# EAGLE board HP85disk_03 (EAGLE 9.2.2)
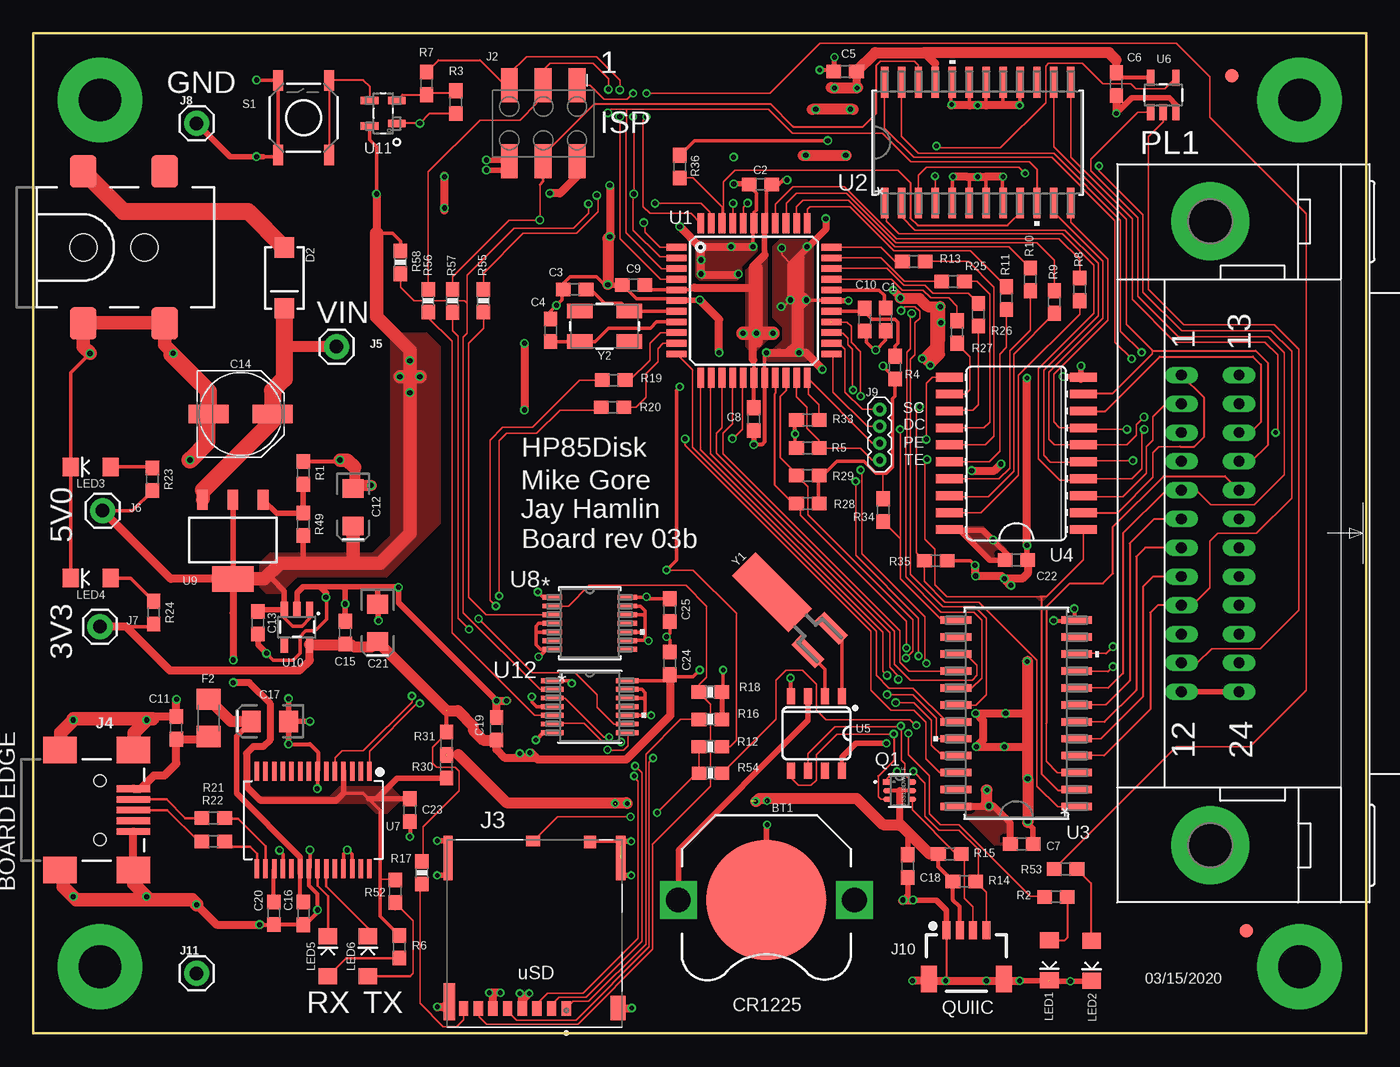
[diagram p2: board, top side]
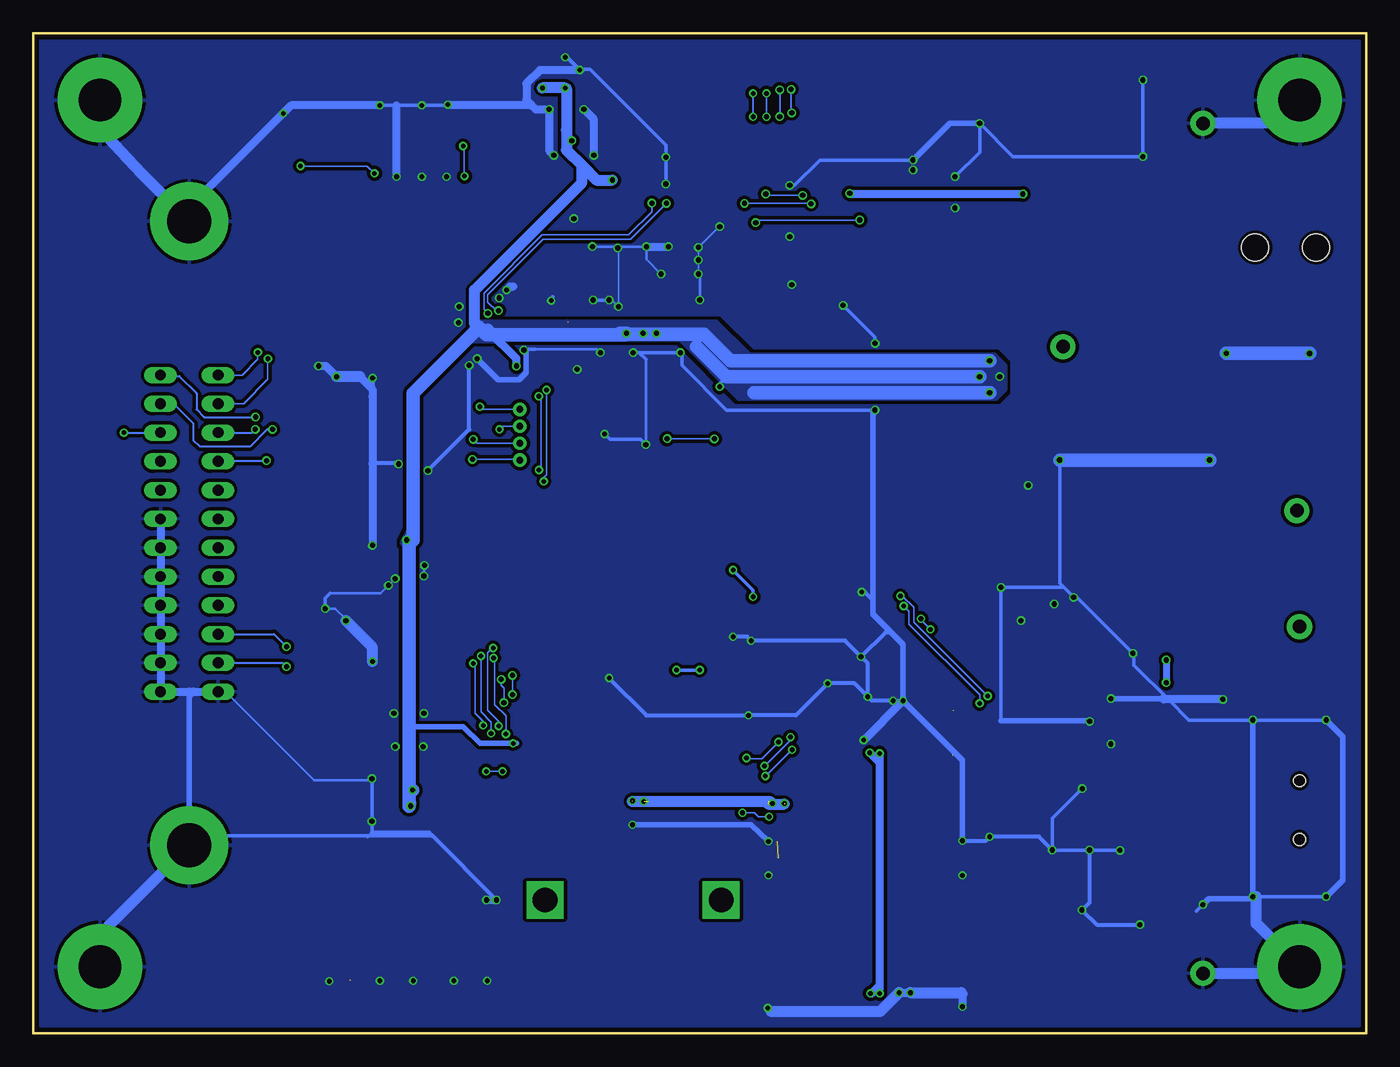
[diagram p3: board, bottom side, seen from below]

Size 100 x 75 mm. Coordinates in mm from the lower left corner, seen from the top.
Outline: 0,75 100,75 100,0 0,0 0,75
Copper layers (1*16): Top 0.035mm / dielectric 1.5mm / Bottom 0.035mm
Design rules "SparkFun-2-layer-FAB-LIMIT": minimum track width 4mil, minimum drill 6mil, track to track 4mil, track to pad 4mil, pad to pad 4mil, via to via 4mil, smd to smd 4mil, copper to edge 4mil, drill to drill 4mil, minimum pad ring 5mil, minimum via ring 5mil, stop-mask expansion 4mil, vias tented up to drill 25mil, thermal gap 10mil
Net classes: 0 default: width 0.102 mm, drill 0.305 mm, clearance 0.102 mm
vRestrict: area 0.6,22.4 to 2,30.6; area 5.7,23.1 to 7.4,30.6; area 47.9,10.8 to 48.5,11.3; area 50.4,10.7 to 50.9,11.6; area 11.3,29.3 to 12.7,31.6; area 0.3,13 to 9.4,25

## Footprints (pad centres in the part's own frame; a part is rotated, then mirrored left to right if it is on the bottom)
BATTCON_12MM_PTH = smd 9 x 9: GND 0,0 | drill 1.854 square: VCC@1 6.604,0; VCC@2 -6.604,0
0603 = smd 1.1 x 1: 1 -0.85,0; 2 0.85,0
EIA3216 = smd 1.4 x 1.6: + 1.4,0; - -1.4,0
PANASONIC_D = smd 3 x 1.4: + 2.4,0; - -2.4,0
SMA-DIODE = smd 1.524 x 1.47: A -2.277,0; C 2.277,0
1206 = smd 1.6 x 1.8: 1 -1.4,0; 2 1.4,0
STANDOFF-ELECTRICAL = drill 3.2 pad 6.35: P1 0,0
POWER_JACK_SMD_OVERPASTE_SUPER_BOMB_DIGITY = smd 2 x 2.4: GND 0,-5.7; P$4 6.1,-5.7; VIN0 0,5.7; VIN1 6.1,5.7 | hole 2.032: 0,0; 4.572,0
2X3_SMD = smd 1.27 x 2.54: 1 -2.54,-2.85; 2 -2.54,2.85; 3 0,-2.85; 4 0,2.85; 5 2.54,-2.85; 6 2.54,2.85
MOLEX_503398-1892 = smd 0.7 x 1.1: 1 -2.38,5.625; 2 -1.28,5.625; 3 -0.18,5.625; 4 0.92,5.625; 5 2.02,5.625; 6 3.12,5.625; 7 4.22,5.625; 8 5.32,5.625 | smd 0.9 x 0.93: 9 -4.17,-6.84 | smd 1.05 x 0.78: 10 0.095,-6.915 | smd 1.14 x 1.83: P1 -6.26,5.61 | smd 0.86 x 2.8: P2 6.4,5.125 | smd 0.7 x 3.33: P3 -6.48,-5.64; P4 6.48,-5.64
USB-MINIB = smd 2.5 x 0.5: D+ 2.5,0; D- 2.5,0.8; GND 2.5,-1.6; ID 2.5,-0.8; VBUS 2.5,1.6 | smd 2.5 x 2: S1 -3,4.5; S2 2.5,4.5; S3 -3,-4.5; S4 2.5,-4.5 | hole 0.9: 0,2.2; 0,-2.2
1X01 = drill 1.016 pad 1.88: 1 0,0
1X04_1.27MM = drill 0.508 pad 1: 1 0,0; 2 1.27,0; 3 2.54,0; 4 3.81,0
QUIIC_1X04_1MM_RA = smd 0.6 x 1.35: 1 -1.5,0; 2 -0.5,0; 3 0.5,0; 4 1.5,0 | smd 1.2 x 2: G1 -2.8,-3.675; G2 2.8,-3.675
FIDUCIAL-1X2 = smd 1 x 1: 1 0,0
LED-1206 = smd 1.2 x 1.4: A -1.5,0; C 1.5,0
24HP = drill 0.813 long: 1 -11.874,-2.159; 2 -9.716,-2.159; 3 -7.556,-2.159; 4 -5.397,-2.159; 5 -3.239,-2.159; 6 -1.079,-2.159; 7 1.079,-2.159; 8 3.239,-2.159; 9 5.397,-2.159; 10 7.556,-2.159; 11 9.716,-2.159; 12 11.874,-2.159; 13 -11.874,2.159; 14 -9.716,2.159; 15 -7.556,2.159; 16 -5.397,2.159; 17 -3.239,2.159; 18 -1.079,2.159; 19 1.079,2.159; 20 3.239,2.159; 21 5.397,2.159; 22 7.556,2.159; 23 9.716,2.159; 24 11.874,2.159 | drill 3.302 pad 5.842: G -23.393,0; G1 23.393,0
SOT-363 = smd 0.6 x 0.42: 1 -0.95,0.65; 2 -0.95,0; 3 -0.95,-0.65; 4 0.95,-0.65; 5 0.95,0; 6 0.95,0.65
0603-RES = smd 1.1 x 1: 1 -0.85,0; 2 0.85,0
TACTILE-SWITCH-SMD = smd 1.524 x 0.762: 1 -2.794,1.905; 2 2.794,1.905; 3 -2.794,-1.905; 4 2.794,-1.905
TQFP44 = smd 1.5 x 0.5: 1 -5.8,4; 2 -5.8,3.2; 3 -5.8,2.4; 4 -5.8,1.6; 5 -5.8,0.8; 6 -5.8,0; 7 -5.8,-0.8; 8 -5.8,-1.6; 9 -5.8,-2.4; 10 -5.8,-3.2; 11 -5.8,-4; 23 5.8,-4; 24 5.8,-3.2; 25 5.8,-2.4; 26 5.8,-1.6; 27 5.8,-0.8; 28 5.8,0; 29 5.8,0.8; 30 5.8,1.6; 31 5.8,2.4; 32 5.8,3.2; 33 5.8,4 | smd 0.5 x 1.5: 12 -4,-5.8; 13 -3.2,-5.8; 14 -2.4,-5.8; 15 -1.6,-5.8; 16 -0.8,-5.8; 17 0,-5.8; 18 0.8,-5.8; 19 1.6,-5.8; 20 2.4,-5.8; 21 3.2,-5.8; 22 4,-5.8; 34 4,5.8; 35 3.2,5.8; 36 2.4,5.8; 37 1.6,5.8; 38 0.8,5.8; 39 0,5.8; 40 -0.8,5.8; 41 -1.6,5.8; 42 -2.4,5.8; 43 -3.2,5.8; 44 -4,5.8
DW24 = smd 2.311 x 0.559: 1 -4.521,6.985; 2 -4.521,5.715; 3 -4.521,4.445; 4 -4.521,3.175; 5 -4.521,1.905; 6 -4.521,0.635; 7 -4.521,-0.635; 8 -4.521,-1.905; 9 -4.521,-3.175; 10 -4.521,-4.445; 11 -4.521,-5.715; 12 -4.521,-6.985; 13 4.521,-6.985; 14 4.521,-5.715; 15 4.521,-4.445; 16 4.521,-3.175; 17 4.521,-1.905; 18 4.521,-0.635; 19 4.521,0.635; 20 4.521,1.905; 21 4.521,3.175; 22 4.521,4.445; 23 4.521,5.715; 24 4.521,6.985
SO20L = smd 0.66 x 2.032: 1 -5.715,-5.029; 2 -4.445,-5.029; 3 -3.175,-5.029; 4 -1.905,-5.029; 5 -0.635,-5.029; 6 0.635,-5.029; 7 1.905,-5.029; 8 3.175,-5.029; 9 4.445,-5.029; 10 5.715,-5.029; 11 5.715,5.029; 12 4.445,5.029; 13 3.175,5.029; 14 1.905,5.029; 15 0.635,5.029; 16 -0.635,5.029; 17 -1.905,5.029; 18 -3.175,5.029; 19 -4.445,5.029; 20 -5.715,5.029
SO08-0.15 = smd 0.6 x 1.2: 1 -1.905,-2.8; 2 -0.635,-2.8; 3 0.635,-2.8; 4 1.905,-2.8; 5 1.905,2.8; 6 0.635,2.8; 7 -0.635,2.8; 8 -1.905,2.8
SOT23-5 = smd 0.55 x 1.2: 1 -0.95,-1.3; 2 0,-1.3; 3 0.95,-1.3; 4 0.95,1.3; 5 -0.95,1.3
SSOP28DB = smd 0.348 x 1.397: 1 -4.225,-3.656; 2 -3.575,-3.656; 3 -2.925,-3.656; 4 -2.275,-3.656; 5 -1.625,-3.656; 6 -0.975,-3.656; 7 -0.325,-3.656; 8 0.325,-3.656; 9 0.975,-3.656; 10 1.625,-3.656; 11 2.275,-3.656; 12 2.925,-3.656; 13 3.575,-3.656; 14 4.225,-3.656; 15 4.225,3.656; 16 3.575,3.656; 17 2.925,3.656; 18 2.275,3.656; 19 1.625,3.656; 20 0.975,3.656; 21 0.325,3.656; 22 -0.325,3.656; 23 -0.975,3.656; 24 -1.625,3.656; 25 -2.275,3.656; 26 -2.925,3.656; 27 -3.575,3.656; 28 -4.225,3.656
TSSOP14_4P50X5P10 = smd 1.473 x 0.356: 1 -2.819,1.95; 2 -2.819,1.3; 3 -2.819,0.65; 4 -2.819,0; 5 -2.819,-0.65; 6 -2.819,-1.3; 7 -2.819,-1.95; 8 2.819,-1.95; 9 2.819,-1.3; 10 2.819,-0.65; 11 2.819,0; 12 2.819,0.65; 13 2.819,1.3; 14 2.819,1.95
SOT223-ALT1 = smd 0.813 x 1.524: 1 -2.271,-3.02; 2 0,-3.02; 3 2.288,-3.02 | smd 3.124 x 1.905: 4 0,2.921
21-0052F = smd 0.559 x 1.321: 1 -0.775,-1.016; 2 0.965,-1.016; 3 0.965,1.016; 4 -0.965,1.016
PW14 = smd 1.676 x 0.356: 1 -2.819,1.95; 2 -2.819,1.3; 3 -2.819,0.65; 4 -2.819,0; 5 -2.819,-0.65; 6 -2.819,-1.3; 7 -2.819,-1.95; 8 2.819,-1.95; 9 2.819,-1.3; 10 2.819,-0.65; 11 2.819,0; 12 2.819,0.65; 13 2.819,1.3; 14 2.819,1.95
CRYSTAL-SMD-2X6-CYL = smd 2.5 x 6: SHEILD 0,5.08 | smd 1 x 2.5: X1 -1.27,0; X2 1.27,0
CRYSTAL-SMD-5X3.2-4PAD = smd 1.9 x 1.1: 1 -1.85,-1.15; 2 1.85,-1.15; 3 1.85,1.15; 4 -1.85,1.15

## Placement (x,y rotation side)
BT1  [BATTCON_12MM_PTH]  55,10 180 top
C1  0.1uF  [0603]  63.94,53.54 270 top
C2  0.1uF  [0603]  54.56,63.67 0 top
C3  22pF  [0603]  40.62,55.8 0 top
C4  22pF  [0603]  38.81,52.73 270 top
C5  0.1uF  [0603]  60.91,72.14 0 top
C6  0.1uF  [0603]  81.25,71.19 90 top
C7  0.1uF  [0603]  74.15,14.2 180 top
C8  0.1uF  [0603]  54.06,46.07 90 top
C9  0.1uF  [0603]  45.03,56.12 0 top
C10  0.1uF  [0603]  62.37,53.53 270 top
C11  0.1uF  [0603]  10.73,22.91 90 top
C12  10uF  [EIA3216]  23.99,39.46 270 top
C13  0.1uF  [0603]  16.85,30.79 270 top
C14  47uF  [PANASONIC_D]  15.55,46.45 0 top
C15  1.0uF  [0603]  23.4,30.06 90 top
C16  0.1uF  [0603]  20.27,8.99 270 top
C17  10uF  [EIA3216]  17.76,23.4 180 top
C18  0.1uF  [0603]  65.6,12.55 270 top
C19  0.1uF  [0603]  34.75,22.85 90 top
C20  0.1uF  [0603]  18.04,9.01 270 top
C21  10uF  [EIA3216]  25.83,30.78 270 top
C22  0.1uF  [0603]  73.75,35.5 180 top
C23  0.1uF  [0603]  28.25,16.75 270 top
C24  0.1uF  [0603]  47.75,27.75 90 top
C25  0.1uF  [0603]  47.75,31.75 270 top
D2  MBRA140  [SMA-DIODE]  18.83,56.66 270 top
F2  6V/0.5A  [1206]  13.15,23.66 90 top
H1  STANDOFF_ELECTRICAL  [STANDOFF-ELECTRICAL]  5,5 0 top
H2  STANDOFF_ELECTRICAL  [STANDOFF-ELECTRICAL]  95,5 0 top
H3  STANDOFF_ELECTRICAL  [STANDOFF-ELECTRICAL]  95,70 0 top
H4  STANDOFF_ELECTRICAL  [STANDOFF-ELECTRICAL]  5,70 0 top
J1  POWER_JACKSUPER_BOMB_DIGITY  [POWER_JACK_SMD_OVERPASTE_SUPER_BOMB_DIGITY]  3.75,58.94 0 top
J2  [2X3_SMD]  38.25,68.25 180 top
J3  503398-1892  [MOLEX_503398-1892]  37.6,7.5 180 top
J4  USB_MINI-B_SMT  [USB-MINIB]  5,16.75 0 top
J5  [1X01]  22.75,51.5 0 top
J6  [1X01]  5.2,39.2 0 top
J7  [1X01]  5,30.5 0 top
J8  [1X01]  12.25,68.25 0 top
J9  [1X04_1.27MM]  63.5,46.8 270 top
J10  [QUIIC_1X04_1MM_RA]  70,7.75 0 top
J11  [1X01]  12.25,4.5 0 top
JP8  FIDUCIAL1X2  [FIDUCIAL-1X2]  91.02,7.69 0 top
JP9  FIDUCIAL1X2  [FIDUCIAL-1X2]  89.93,71.81 0 top
LED1  Green  [LED-1206]  76.24,5.48 270 top
LED2  Green  [LED-1206]  79.4,5.46 270 top
LED3  Green  [LED-1206]  4.31,42.48 180 top
LED4  Green  [LED-1206]  4.31,34.14 180 top
LED5  Yellow  [LED-1206]  22.1,5.77 90 top
LED6  Red  [LED-1206]  25.1,5.77 90 top
PL1  [24HP]  88.3,37.5 270 top
Q1  BSS138DW-7-F  [SOT-363]  65,18.2 0 top
R1  715R  [0603]  20.25,42.03 270 top
R2  1K  [0603]  76.72,10.23 0 top
R3  100k  [0603]  31.7,69.84 270 top
R4  120R  [0603]  64.65,49.93 90 top
R5  10k  [0603]  58.1,43.9 0 top
R6  1k  [0603]  27.46,6.49 270 top
R7  1k  [0603]  29.5,71.25 270 top
R8  120R  [0603]  78.5,55.8 90 top
R9  120R  [0603]  76.6,54.85 90 top
R10  120R  [0603]  74.8,56.55 90 top
R11  120R  [0603]  73,55.15 90 top
R12  100k  [0603-RES]  50.79,21.5 0 top
R13  120R  [0603]  66.05,57.9 180 top
R14  2.2K  [0603]  69.85,11.4 0 top
R15  2.2K  [0603]  68.75,13.45 0 top
R16  100k  [0603-RES]  50.79,23.55 0 top
R17  100k  [0603-RES]  29.16,12.04 90 top
R18  100k  [0603-RES]  50.79,25.59 0 top
R19  120R  [0603]  43.54,48.99 180 top
R20  120R  [0603]  43.46,46.96 180 top
R21  27R  [0603]  13.51,16.15 0 top
R22  27R  [0603]  13.51,14.4 0 top
R23  1k  [0603]  8.94,41.56 270 top
R24  240R  [0603]  9.03,31.56 270 top
R25  120R  [0603]  69,56.4 180 top
R26  120R  [0603]  70.9,53.9 90 top
R27  120R  [0603]  69.3,52.6 90 top
R28  2.2K  [0603]  58.1,39.75 180 top
R29  2.2K  [0603]  58.1,41.85 180 top
R30  NOSTUFF  [0603]  31,20 90 top
R31  0R  [0603]  31,21.75 270 top
R33  10K  [0603]  58.1,46 0 top
R34  10K  [0603]  63.75,39.25 270 top
R35  10K  [0603]  67.7,35.45 180 top
R36  10K  [0603]  48.5,65 270 top
R49  240R  [0603]  20.25,38.18 270 top
R52  1k  [0603]  27.15,10.66 270 top
R53  1K  [0603]  77.44,12.32 0 top
R54  10k  [0603-RES]  50.81,19.51 0 top
R55  1k  [0603-RES]  33.77,54.94 90 top
R56  1k  [0603-RES]  29.63,54.94 90 top
R57  1k  [0603-RES]  31.45,54.93 90 top
R58  10k  [0603-RES]  27.54,57.82 270 top
S1  PUSHBUTTON  [TACTILE-SWITCH-SMD]  20.28,68.67 90 top
U1  ATMEGA1284P-AUR  [TQFP44]  54.07,54.96 0 top
U2  TPIC6A596DWRG4  [DW24]  70.85,66.8 90 top
U3  SN75ALS162DWR  [DW24]  73.75,24 180 top
U4  75ALS160  [SO20L]  73.75,43.5 90 top
U5  DS1307Z  [SO08-0.15]  58.75,22.5 180 top
U6  SN74LVC1G32DCKR  [SOT23-5]  84.77,70.38 0 top
U7  FT232RL  [SSOP28DB]  21,16 180 top
U8  MC74ACT125DTR2G  [TSSOP14_4P50X5P10]  41.75,30.75 0 top
U9  LM1117  [SOT223-ALT1]  14.98,37 180 top
U10  LP5907MFX-3.3  [SOT23-5]  19.78,30.46 180 top
U11  MAX811LEUS+T  [21-0052F]  26.25,69 90 top
U12  SN74LVC125APWR  [PW14]  41.75,24.5 0 top
Y1  32.768kHz  [CRYSTAL-SMD-2X6-CYL]  59,29.5 45 top
Y2  20MHz  [CRYSTAL-SMD-5X3.2-4PAD]  42.85,53.03 180 top

## Tracks (layer width: path | path; a pad name or v marks a point on that pad's centre or on a via)
3.3V  (via drill 0.35)  (1 unrouted)
  Top 0.127: 51.64,23.22 R16.2 | R17.2 29.23,12.96 29.23,15.48 31.95,18.2 31.95,19.65 31.65,19.95 30.25,19.95 29.95,20.25 29.95,21.45 31,22.5 R31.1
  Top 0.178: C15.1 23.79,29.21 23.84,29.16
  Top 0.254: 20.75,28 20.73,28.02 | 51.74,25.49 R18.2 R16.2 51.75,23.66 v51.75,27.25 | 48.05,26.75 47.88,26.57 47.75,26.45 U12.14 | v50,27.25 49.5,26.75 48.05,26.75 | R24.2 8.83,30.51 6.51,30.51 6.5,30.5 | C24.1 47.9,26.9 48.05,26.75
  Top 0.305: R31.1 31,24.2
  Top 0.406: R31.1 31.15,22.75
  Top 0.61: 23.84,29.16 24,29 | 25.45,29 C21.+ | 20.75,28 19.95,27.2 10.25,27.2 6.95,30.5 6.5,30.5 J7.1 | 20.73,28.02 U10.5 | 47.88,26.57 47.8,26.5 47.8,23.85 44.5,20.55 37.85,20.55 37.65,20.75 | 37.65,20.75 36.5,20.75 v36.5,21 | v36.5,3 36.75,2.75 36.68,2.68 J3.4 36.68,2.48 v37.2,3 | 37.65,20.75 37.35,21.05 v37.25,21.05 | 37.65,20.75 37.55,20.65 35.4,20.65 34.75,21.3 C19.1
  Top 0.813: U10.5 23.84,29.16 | 24,29 25.45,29 | C21.+ 30.96,24.25 31,24.25 | 31,24.2 31.85,24.2 33,23.05 33,22.75 33.75,22 C19.1
  Bottom 0.254: v50,27.25 v51.75,27.25
  Bottom 0.61: v36.5,3 36.5,3.6 | 36.5,3.6 36.5,20.3 | 36.5,20.3 v36.5,21 | v37.2,3 37.1,3 36.5,3.6 | v37.25,21.05 36.5,20.3
3.3V_F
  Top 0.305: C20.1 18.04,12.31 U7.17
5V  (via drill 0.35, 0.38)
  Top 0.127: v54.25,52.5 54,52.5 | v61.8,70.9 61.83,70.9 61.85,70.92 | 64.65,49.05 64.65,49.1 64.65,49.15 | R34.1 63.75,42 | R52.1 27.11,11.55 26,11.55 | v47.5,34.75 49.5,34.75 52.75,31.5 52.75,22 52.25,21.5 R12.2
  Top 0.178: C7.2 73.25,14.15 | 73.17,14.07 72.92,13.82 | U4.20 68.76,37.75 69.5,37.75
  Top 0.254: U1.38 55,60.89 55,63.26 C2.2 55.92,63.67 | C9.2 45.88,56.02 46.14,55.76 U1.5 49.41,55.76 49.58,55.92 | U1.17 54.07,49.25 54.07,50.43 54,50.5 | 53.83,55.92 54,55.75 | U10.1 20.73,31.13 20.15,30.55 19.45,30.55 18.83,31.17 U10.3 | R6.1 26,8.8 26,11.55 26,16.75 25.15,17.6 24.73,18.02 23.27,18.02 | U11.4 25.23,67.02 25.75,66.5 v25.75,62.95 | R4.1 64.65,49.1 | 64.65,49.15 v63.75,50.05 | 64.65,49.05 64.65,47.8 64.45,47.6 64.45,42.45 64,42 63.75,42 63.2,42 62.3,42.9 60.3,42.9 59.25,41.85 R29.1 58.9,41.8 58.9,39.8 R28.1 | v59.6,66.95 49.6,66.95 R36.1 | R23.2 7.43,39.2 J6.1 | U8.14 45.95,32.7 | 45.95,32.7 v46,32.75 | v47.5,34.75 48.25,35.5 48.25,48.25 v48.5,48.5 | C25.1 46.05,32.6 45.95,32.7 | R58.1 27.54,59.41 26.95,60 25.75,60
  Top 0.305: 55.92,63.67 56.25,64 v56.55,64 | 54,57.5 54.4,57.5 | C8.2 54.06,49.24 54.07,49.25 | U6.5 81.61,71.68 C6.2 | U5.8 60.66,20.7
  Top 0.406: 54.87,58.37 U1.38 | U9.2 U9.4 17.92,34.08 18.83,33.17 U10.3 16.97,31.76 C13.1 | 14.98,31.52 15,31.5 | 26.08,35.33 26,35.25 | C22.2 71.75,35.5 69.5,37.75 71.25,37.75 v72,37 73.25,35.75 | R49.2 20.25,35.25 | U7.4 23.27,18.02 22.75,17.5 | C23.1 25.75,17.6 | 25.75,17.6 25.15,17.6 | 67.67,72.72 U2.21 | 73.1,14 73.25,14.15 | R30.1 27.3,19.15 25.75,17.6 | v64,21.75 61.7,21.75 60.66,20.7
  Top 0.508: U9.4 14.98,31.52 | 15,31.5 v15,28 | v15,26.3 16.2,26.3 17.75,24.75 17.75,22 17.25,21.5 16.5,21.5 16,21 16,18.5 17,17.5 22.75,17.5 | U3.24 71.67,17.02 v71.7,17.05 72.05,17.05 73.25,15.85 73.25,14.15 73.17,14.07
  Top 0.61: 54,50.5 54,52.5 54,55.75 54,57.5 54.87,58.37 | 49.58,55.92 53.83,55.92 | J2.2 40.79,64.29 39.5,63 v38.75,63 | v25.75,62.95 25.75,60 | 54.4,57.5 54.4,51.75 | U9.4 10.32,34.08 J6.1 | 66.85,73.55 67.67,72.72 | C6.2 81.25,73 | C5.2 61.76,70.94 v61.8,70.9 | v60.1,70.9 60.08,70.92 59.85,70.92
  Top 0.813: C5.2 63.17,73.55 66.85,73.55 80.7,73.55 81.25,73 | 59.85,70.92 61.85,70.92 | v71.7,17.05 71.5,17.25 71.5,18.25 v71.55,18.25
  Top 1.016: U9.4 17.33,34.08 18.5,35.25 20.25,35.25 24,35.25 | 24,35.25 26,35.25 28.25,37.5 v28.25,48.05 v28.25,50.45 28.25,51.25 25.75,53.75 25.75,60 | C12.+ 24,35.25 | v55.5,52.5 54,52.5 v53.25,52.5 | v29,49.25 v27.5,49.25
  Bottom 0.127: v72,37 71.5,37
  Bottom 0.254: v48.5,48.5 48.5,48.75 48,49.25 | v47.5,34.75 46,33.25 v46,32.75
  Bottom 0.305: v59.6,66.95 60,67.35 60,67.75
  Bottom 0.406: 71.8,23 67.75,23 66.5,21.75 v64,21.75 63.75,21.75
  Bottom 0.508: v15,28 v15,26.3
  Bottom 0.61: v38.75,63 38.7,62.95 v25.75,62.95 | 66.13,52.52 66.56,52.95 66.9,53.29 | 50.25,51.5 50.25,51.9 49.7,52.45 | v60.1,70.9 60.05,70.85 60,70.85 | 65.9,52.75 63.75,50.6 v63.75,50.05
  Bottom 0.813: 60,70.85 60,67.75 60,66.25 58.85,65.1 | 58.85,65.1 57.75,64 v56.55,64 | 66.9,53.29 66.9,55.75 58.85,63.8 58.85,65.1 | v60.1,70.9 v61.8,70.9
  Bottom 1.016: v55.5,52.5 55.45,52.45 49.7,52.45 47.7,50.45 v28.25,50.45 | v55.5,52.5 56,52.5 | 50.25,51.5 48,49.25 v29,49.25 | 45.95,48.05 v28.25,48.05 | 66.56,52.95 71.5,48 71.5,37 | 66.13,52.52 65.9,52.75 | 71.8,36.95 71.8,23 71.8,18.35 | 71.8,18.35 71.8,17.03 71.77,17.25 | 71.8,18.35 71.65,18.35 v71.55,18.25 | 66,52.39 55.61,52.39 v55.5,52.5
  pour Top (isolate 0.254): 27.3,52.5 26.8,52 26.8,37.3 26.25,36.75 25.5,36 17.75,36 17,35.25 17,33.5 17.5,33 18.25,33 18.5,33 19.75,34.25 26.5,34.25 30.5,38.25 30.5,51.5 29.5,52.5
  pour Top: 69.5,38 71.25,38 73.25,36 73.25,35.5 71.75,35.5 69.5,37.75
  pour Top: 17,17.75 22.25,17.75 23,18.5 26.75,18.5 27.5,17.75 27.5,17.5 26.5,16.5 25.75,16.5 25,17.25 17,17.25
  pour Top: 53.5,53.25 53.5,57.25 55,58.75 55,52 54.25,51.25 53.75,51.25 53.5,51.5
  pour Bottom: 27,48.25 27.75,47.5 47.1,47.5 51.5,51.9 66.25,51.9 66.25,53 65.75,53.5 48.75,53.5 46.25,51 27.85,51 27,50.15
  pour Bottom: 72,37.75 72.5,36.75 72,36.25 71.75,36.25 71.25,36.75 71.25,37.25 71.75,37.75
  pour Bottom: 65.5,53.5 67,53.5 67.25,53.25 67.25,52.05 67,51.8 65.45,51.8 65.25,52 65.25,53.25
  pour Top: 69.75,17.05 71.95,17.05 73.3,15.7 73.3,14.05 73.2,14.15 72.1,14.15 69.75,16.5
5V_SCL  (via drill 0.35)
  Top 0.127: v65.5,28.9 65.5,30.9 57.55,38.85 57.55,39.45 R28.2 | 57.25,39.55 R28.2 | Q1.6 65.4,19.4 65.4,20.23 65.13,20.5 65.13,23 v65.08,23.05 65.03,23 60.15,23 58.12,20.96 U5.6 | 55.62,41.13 57,39.75 R28.2
  Top 0.15: U1.19 55.67,48.01 55.62,47.96 55.62,41.13
  Bottom 0.127: v65.08,23.05 65.08,23.39 65.93,24.25 65.93,28.54 65.58,28.9 v65.5,28.9
5V_SDA  (via drill 0.35)
  Top 0.127: v65.47,28.15 65.98,28.66 65.98,31.02 58.1,38.9 58.1,41 R29.2 57.25,41.97 56.02,43.2 | 63.4,19.3 63.4,17.75 63.6,17.55 Q1.3 | U5.5 56.84,19.16 57.4,18.6 58.35,18.6 58.75,19 58.75,20.9 60.3,22.45 v64.55,22.45
  Top 0.15: U1.20 56.47,48.21 56.02,47.76 56.02,43.2 | R29.2 57.25,42.05
  Top 0.152: v64.55,22.45 64.55,20.45 63.4,19.3
  Bottom 0.127: v64.55,22.45 64.55,23.82 65.38,24.65 65.38,27.98 65.47,28.07 v65.47,28.15
AREF
  Top 0.254: U1.29 arc90 U1.29 63.45,55.75 63.84,55.36 63.84,54.49 C1.1
AVCC
  Top 0.254: U1.27 62.15,54.16 62.22,54.23 | 62.22,54.23 C10.1 | R4.2 64.65,51.52 64.87,51.74 64.87,53.34 64.66,53.55 62.9,53.55 62.22,54.23
CLK_5V0
  Top 0.127: R56.1 29.63,53.67 31.4,51.9 31.4,30.05 37.6,23.85 U12.5
D+
  Top 0.178: R22.1 12.41,14.4 10.06,16.75 J4.D+
D-
  Top 0.178: R21.1 11.4,16.15 10,17.55 J4.D-
DC  (via drill 0.35)
  Top 0.127: U1.23 60,50.83 60,48.1 62.57,45.53 J9.2 | v65.03,45.3 65.05,45.28 65.05,37.1 | U3.13 68.17,30.98 65.05,34.1 65.05,37.1 | R34.2 65.05,37.1
  Bottom 0.127: v65.03,45.3 64.8,45.53 J9.2
FT_D+
  Top 0.178: R22.2 14.76,14 16.25,14 16.77,13.47 U7.15
FT_D-
  Top 0.152: 14.41,16.1 R21.2
  Top 0.178: U7.16 17.43,14.03 15.35,16.1 14.41,16.1
FT_RXD  (via drill 0.35)
  Top 0.127: R20.2 42.4,46.75 39.5,46.75 37.75,45 35.5,45 34.95,44.45 v34.95,32.8 | v28.4,25.3 28.4,24.85 24.75,21.2 23.15,21.2 22.62,20.68 U7.5
  Bottom 0.127: v28.4,25.3 33.93,30.83 33.93,31.94 34.79,32.8 v34.95,32.8
FT_TXD  (via drill 0.35)
  Top 0.127: R19.2 40.99,48.99 37.45,45.45 35.2,45.45 34.25,44.5 34.25,32.5 v34.7,32.05 | v29,24.75 28.8,24.75 25.23,21.18 U7.1
  Bottom 0.127: v29,24.75 29,25.4 34.3,30.7 34.3,31.65 v34.7,32.05
GND  (via drill 0.35, 0.38)  (2 unrouted)
  Top 0.127: J4.S1 2.04,21.25 | 70.22,69.65 70.22,69.64 70.25,69.6 | v70.85,69.6 71.5,69.6 | v70.85,64.25 71,64.25 | v61.3,69.3 61.49,69.3 61.5,69.29 | U4.10 78.6,49.04 78.6,49 | v60.95,65.85 v60.96,65.84 61,65.84 | v57.95,65.85 v57.94,65.84 57.75,65.84 | 53.58,63.67 C2.1 53.48,63.67 53.45,63.7 | 56.85,57.7 56.15,58.4 v56.15,58.9 | 57.5,55 57.6,55.1 57.6,55.5 | v56.8,55 56.3,54.5 v56.1,54.5 | J2.6 35.61,65.3 35.61,64.75 | v23.4,32.2 23.4,33.35 | J4.S2 7.55,21.26 | v3,23.5 3,23.59 | v16.97,8.15 v16.98,8.16 17.09,8.16 | J4.S4 7.54,12.24 | J4.S3 2.26,12.01 2.24,12.01 | v73.35,33.6 73.35,33.55 | 76.24,3.9 v77.8,3.9 78,3.9 79.4,3.9 LED2.C | R5.1 57.25,44.15 57.15,44.25 | 67.8,51.2 67.55,51.45 67.55,51.5 67.6,51.55 | v25.9,30.95 25.9,30.9 25.88,30.88
  Top 0.152: U11.1 27.29,68.25 v29,68.25 29.74,68.99 R3.2 | J10.1 68.5,4 v68.45,3.95 | J3.P4 31.1,13.16 31.1,14.45
  Top 0.178: U1.6 48.71,54.96 48.85,55.1 | 57,55.25 56.88,55.38 56.8,55.3 v56.8,55 56.85,55 | 57.5,55.25 57.75,55 | 57.5,54.5 57.2,54.2 | U1.39 54,60.69 54,60.5 | v57.45,51.05 57.5,51.1 | v30.85,64.25 30.85,64.35 | v50.1,56.95 50.1,56.9 | v30.85,61.9 30.85,61.7
  Top 0.254: v54.05,44.15 v54.06,44.16 | U1.39 54.07,61.57 54.25,61.75 54.25,63 53.58,63.67 | U1.28 59.83,55 58.05,55 v58,55 | U1.18 54.87,50.87 54.9,50.9 54.9,50.95 v55,51.05 | C1.2 63.94,51.99 v63.2,51.25 63.1,51.25 62.5,51.85 62.5,52.55 C10.2 | 43.13,56.12 v43.1,56.15 42.85,56.15 42.25,56.75 40.25,56.75 39.77,56.27 C3.1 39.67,55.7 39.67,55.02 v39.25,54.6 38.81,54.16 C4.1 | C9.1 44.23,56.12 45.25,55.1 48.85,55.1 | 54,60.5 v54,59 | LED4.C LED3.C 2.81,49.55 v4.25,50.99 | v17.5,28.5 18,28 19.5,28 20,28.5 20,29.75 20.39,30.14 20.4,30.14 20.45,30.2 21.15,30.2 22,31.05 22,32.85 | v16.75,71.5 16.79,71.46 S1.2 S1.1 18.38,66 18.12,65.75 17.25,65.75 v16.75,65.75 | U4.10 78.74,49.25 | C22.1 74.55,35.55 | U7.7 21.32,18.38 v21.3,18.35 | U7.26 23.93,13.43 23.6,13.75 v23.55,13.75 23.27,13.47 U7.25 | U7.21 20.75,12.42 v20.75,13.75 | v18.47,13.72 v18.48,13.72 18.75,13.45 18.75,12.37 U7.18 | U2.18 71.48,69.6 70.25,69.6 | U2.20 68.85,71.23 68.85,69.7 v68.9,69.65 70.22,69.65 U2.19 | U2.17 72.75,69.6 71.5,69.6 70.95,69.6 | U2.16 74,71.3 v74,69.6 | v69,64.25 68.94,64.19 U2.5 | v72.75,64.25 72.7,64.2 72.7,62.33 U2.8 | U2.6 70.22,64.25 | U2.7 71.48,64.25 | 57.15,43.8 57.15,44.25 v57.15,44.95 | v61.14,54.96 v61.15,54.95 | v70.65,35.1 70.3,35.45 R35.1 | v46.15,29.45 46.15,29.5 45.9,29.5 | 45.9,29.5 45.9,30 | 45.9,30 45.9,31.25 | 45.9,31.25 45.9,31.7 45.55,32.05 U8.13 | 45.9,31.25 45.75,31.4 U8.12 | 45.9,30 45.8,30.1 U8.10 | 45.9,29.5 44.62,29.5 U8.9 | U8.7 38.05,28.8 37.7,29.15 37.7,30.1 | 37.7,30.1 37.7,30.55 37.9,30.75 U8.4 | U8.5 37.7,30.1 | U8.1 38.25,32.7 v37.85,33.1 | v46.35,23.85 45.8,23.85 | 45.9,25 45.9,23.75 45.8,23.85 | 45.9,25 45.9,25.55 45.65,25.8 U12.13
  Top 0.254: 45.9,25 45.75,25.15 U12.12 | 45.8,23.85 U12.10 | U12.4 37.75,24.5 37.4,24.85 v37.4,25.25 | U12.1 40.2,26.45 v40.4,26.25 | C24.2 47.75,29.5 v47.5,29.75 47.75,30 C25.2 | v44.85,14.4 41.83,14.4 J3.9
  Top 0.305: v23,43 22.88,42.88 R1.1 | 17.09,8.16 C20.2 18.06,8.14 C16.2 20.39,8.14 21.32,9.07 v21.32,9.25 21.32,10.43 20.68,11.07 U7.21 | v19.15,21.7 20.75,21.7 21.35,21.1 21.35,19.68 U7.7 | U1.18 54.87,44.37 54.66,44.16 v54.06,44.16 | C23.2 v28.25,14.75 | v59,72.25 59.95,72.25 C5.1 60.06,73.16 v60.1,73.2 60.1,72.25 | v78.1,31.85 78.1,31.16 | 78.1,31.16 U3.12 | v76.55,30.95 77.89,30.95 78.1,31.16 | v57.15,44.95 57.15,45.9 R33.1 | U5.4 56.84,26.59 56.85,26.6 v56.8,26.65 | v37.7,22 38.25,22.55 U12.7 | U8.7 38.5,28.8 37.95,28.25 v37.9,28.25
  Top 0.406: C8.1 v54.06,44.16 | 53.45,63.7 v52.55,63.7 | C7.1 75,15.4 74.6,15.8 | C9.1 43.13,56.12 | U10.2 19.78,33.03 20.25,33.5 21.5,33.5 | 25.75,33.5 27.35,33.5 v27.4,33.45 27.4,32.3 v34.75,24.95 | 21.5,33.5 23.25,33.5 | 23.25,33.5 25.75,33.5 | 25.75,33.5 25.83,33.42 C21.- | C15.2 23.4,33.35 23.25,33.5 | C13.2 16.85,29.15 v17.5,28.5 | 22,32.85 22,33 21.5,33.5 | v3,10.25 v2.99,10.24 v2.99,10.25 | v8.5,10.25 v8.49,10.24 | J2.6 35.61,65.5 v34,65.5 | 78.74,49.25 v77.25,49.25 | v74.55,36.6 74.55,35.55 | J8.1 14.75,65.75 17.25,65.75 | C17.- 19.16,24.99 19.15,25 v19.15,25.1 | C17.- v20.75,23.4 | C17.- v19.16,21.71 v19.15,21.7 | 78.6,50.1 78.6,49 | 35.61,64.75 v34,64.75 | PL1.24 PL1.12 | 70.22,64.25 70,64.25 | v50,55 48.75,55 48.71,54.96 | 25.88,30.88 25.88,32.12 | J10.1 68.5,9.25 67.75,10 v65.25,10 65.6,10.35 C18.2 | v74,3.95 76.19,3.95 76.24,3.9 | 76.32,3.9 78,3.9 | v77.8,3.9 79.4,3.9 | U1.28 v61.14,54.96 | v81.25,69 82.4,70.15 85.22,70.15 85.72,69.65 U6.3 | v44.85,14.4 44.17,14.4 | 31.1,14.45 v30.3,14.45 | BT1.GND 55,15.45 55.05,15.5 v55.05,15.65 | 31.1,11.85 v30.3,11.85 | v44.85,11.85 44.12,11.85
  Top 0.508: v59.45,61.1 59.45,60.29 58.16,59 v58.05,59 58.05,58.9 56.85,57.7 56.85,55 | 57.35,55.25 57.35,57.95 | 57.6,55.5 57.6,58.2
  Top 0.61: 65.17,9.92 v65.25,10 v66,10 | v55,51.05 56.55,51.05 57.2,51.7 57.2,54.2 57.2,54.9 | v58,55 57.5,54.5 57.5,51.1 57.5,51.05 55.95,51.05 | 57.75,55 57.5,55 v56.8,55 | 58.05,55 57.8,55.25 57.5,55.25 57.35,55.25 57,55.25 | 50.1,56.9 52.85,56.9 | v43.25,63.6 v43.25,59.75 | 30.85,61.7 30.85,64.35 | v36.85,51.75 v36.85,46.75 | J4.S4 J4.GND | v8.5,23.5 8.76,23.76 C11.2 10.73,24.87 10.7,24.9 10.7,25 v10.75,25.05 | 68.1,52 v68.1,53.3 68.1,54.45 v68.05,54.5 | 68.1,52 67.55,51.45 v66.7,50.6 | v12.25,9.65 13.74,8.16 17.09,8.16 | v50.1,56.95 50.1,58.9 v48.5,60.5 | 50.1,59 v54,59 | v57.45,51.05 57.95,51.05 v59.2,49.8 | v74,69.6 71.5,69.6 70.25,69.6 68.85,69.6 | v72.75,64.25 71.48,64.25 71,64.25 70,64.25 v69,64.25 | C6.1 v81.25,69 | v51.45,51.05 51.45,53.55 v50,55 | C22.1 74.6,34.5 74.2,34.1 v72.85,34.1 72.65,34.3 v70.7,34.3 70.65,34.35 v70.65,35.1 | 73.35,33.55 72.95,33.95 | v74.55,36.6 v74.55,49.15 | 68.1,52 68.1,50.9 v67.3,50.1 | v65.95,3.95 67.08,3.95 J10.G1 67.33,3.95 v68.45,3.95 v71.5,3.95 72.67,3.95 J10.G2 72.95,3.92 73.97,3.92 v74,3.95 | v65.05,55.15 65.08,55.17 v64.5,55.75 | 67.6,51.55 67.6,54.3 | 67,50.4 67.8,51.2 | v70.4,42.2 72.1,42.2 v72.6,42.7 | 74.6,23.85 74.45,24 v72.95,24 v70.7,24 71.25,23.45 71.25,22 v70.75,21.5 74.4,21.5 | C19.2 v34.75,24.95 | 34.7,24.95 v34.75,24.95 | v34.75,24.95 35.55,24.95 | J3.6 34.48,3.04 34.43,3.05 | 34.43,3.05 v34.2,3.05 | v35.05,3.05 34.43,3.05 | J3.P2 30.77,1.95 30.3,1.95 v30.3,2 | J3.P1 44.86,1.89 44.9,1.85 v44.9,1.9
  Top 0.813: 74.6,15.8 v74.6,19.1 74.6,23.85 74.6,27.89 74.6,27.9 | 57.75,65.84 61,65.84 | v65.05,55.15 65.1,55.1 66.48,55.1 67.08,54.5 v68.05,54.5 | 61.5,69.29 58.45,69.29 | 24.1,42.44 24.1,40.97 C12.- 24.23,41.1 v25.35,41.1 | v43.25,59.75 43.1,59.6 v43.1,56.15
  Top 1.016: v4.25,50.99 3.75,51.49 J1.GND 3.8,53.29 9.85,53.29 J1.P$4 9.85,51.65 v10.5,51 10.4,51.1 10.4,50.9 | C14.- 13,46.3 | 24.1,42.44 23.54,43 v23,43 | 2.04,21.25 2.04,22.54 v3,23.5 | v8.5,23.5 7.55,22.55 7.55,21.26 | v2.99,10.25 3.23,10.01 11.92,10.01 12.25,9.68 v12.25,9.65 | 2.24,12.01 2.24,11.01 v3,10.25 | 7.54,12.24 7.54,11.21 v8.5,10.25 | 3,23.59 8.95,23.59
  Top 1.27: C14.- 13.15,48.15 10.4,50.9 | 13,46.3 13,44.25 v11.75,43
  Bottom 0.127: 56.75,55 56.6,55 v56.1,54.5 56.1,58.9 56,59 | v50.1,56.95 v50.1,58 v50.1,58.95 48.55,60.5 v48.5,60.5 | 93.9,3.9 H2.P1
  Bottom 0.178: v74.6,19.1 74.7,19 78.95,19 85.58,25.62 PL1.12 | v78.1,31.85 77.35,31.85 76.55,31.05 | 77.75,33 73.95,33 v72.85,34.1 | v70.7,34.3 70.7,34.95 70.5,35.15 | 62.35,51.3 57.7,51.3 v57.45,51.05 | v50,55 50,56.85 v50.1,56.95 | v52.9,56.95 54,58.05 v54,59 56,59 v58.05,59 | v77.25,49.25 77.35,49.15 | 54.05,50.55 v54.05,44.15
  Bottom 0.254: 56.75,55 v58,55 | 54.05,50.55 54.55,51.05 v55,51.05 v51.45,51.05 51.35,50.95 51.35,50.1 48,46.75 v36.85,46.75 37,46.75 | v63.2,51.25 63.15,51.3 62.35,51.3 | v74.6,19.1 74.6,15.05 74.9,14.75 74.9,14.81 87.58,14.81 87.63,14.78 PL1.G1 | v16.75,71.5 v16.75,65.75 26.5,65.75 v29,68.25 29,66.1 v30.85,64.25 | v52.55,63.7 v52.55,65.71 v52.54,65.72 v52.55,65.73 52.55,66.6 58.25,72.3 58.95,72.3 v59,72.25 | v78.1,31.85 78.1,32.65 77.75,33 | v39.25,54.6 36.85,52.2 v36.85,51.75 | v21.95,32.7 23,33.75 v23,43 | v21.95,32.7 22.7,33.45 v27.4,33.45 27.4,23.45 | v21.95,32.7 21.7,32.7 v17.5,28.5 17.42,28.42 17.42,27.62 14.78,24.97 13.3,23.5 v8.5,23.5 v3,23.5 | v3,10.25 8.25,10.25 v8.5,10.25 8.65,10.1 | v12.25,9.65 12.75,9.15 | 70.06,14.81 80.8,14.81 | v43.25,59.75 43.25,59.7 | v43.25,63.6 42.9,63.6 41,65.5 v34,65.5 | v21.3,18.35 21.35,18.35 23.55,16.15 v23.55,13.75 v20.75,13.75 18.5,13.75 v18.47,13.72 | v74,69.6 72.75,69.6 68.95,69.6 v68.9,69.65 | v57.15,44.95 56.75,44.55 54.45,44.55 v54.05,44.15 | v61.15,54.95 61.15,55.15 61.05,55.25 61,55.25
  Bottom 0.305: 16.9,8.15 20.22,8.15 v21.32,9.25 20.75,9.82 v20.75,13.75 | 59,72.3 v59,72.25 59.95,73.2 v60.1,73.2 | v65.25,10 70.06,14.81 70.3,15.05 74.6,15.05 | v56.8,26.65 54,23.85 v46.35,23.85 42.8,23.85 v40.4,26.25 38.4,26.25 v37.4,25.25 | v37.85,33.1 37.6,33.1 37,32.5 | v37.9,28.25 36.05,30.1 35.65,30.1 | v37.9,28.25 39.1,29.45 v46.15,29.45 46.45,29.75 v47.5,29.75 | v37.4,25.25 37.1,24.95 v35.5,24.95 v34.75,24.95 | v37.4,25.25 37.4,27.75 v37.9,28.25 | v30.3,14.45 28.55,14.45 v28.25,14.75 24.55,14.75 v23.55,13.75 | v72.6,42.7 72.65,42.75 74.55,42.75 | v74.55,49.15 74.55,47.75 | v70.4,42.2 67.3,45.3 v67.3,50.1
  Bottom 0.406: 37,46.75 37,32.5 37,31.45 35.65,30.1 34.75,29.2 v34.75,24.95 30.3,20.5 v30.3,14.45 | v12.25,9.65 11.8,10.1 8.65,10.1 | v3,23.5 1.75,22.25 1.75,11.5 v3,10.25 | v8.5,23.5 v8.5,10.25 | v34,65.5 31.25,68.25 v29,68.25 | 88.28,25.32 88.3,25.32 PL1.G1 | 88.28,25.32 88.28,25.62 | 87.97,25.62 88.28,25.32 | v19.15,25.1 15.25,25.1 14.9,25.1 14.78,24.97 | 27.4,23.45 20.8,23.45 v20.75,23.4 | v66.7,50.6 65.13,49.03 63.57,49.03 63.05,49.55 63.05,51.1 v63.2,51.25 | v55.05,15.65 46.15,15.65 v44.85,14.4
  Bottom 0.61: v10.75,25.05 15.2,25.05 15.25,25.1 | PL1.G 88.3,61.45 88.08,62.17 v81.25,69 80.65,69.6 v74,69.6 | v59,72.25 62,72.25 63,71.25 63,70 62.65,69.65 | v72.75,64.25 72.75,69.6 | v68.9,69.65 62.65,69.65 | 62.65,69.65 62.3,69.3 v61.3,69.3 61.3,66.2 v60.95,65.85 | v65.25,10 v66,10 | v57.95,65.85 57.95,68.55 v58.7,69.3 | PL1.18 PL1.19 PL1.20 PL1.21 PL1.22 PL1.23 PL1.24 87.97,25.62 | 88.28,25.62 85.68,25.62 PL1.12 | 77.15,49.15 v77.25,49.25 78.05,50.05 v78.6,50.05 | 75.5,49.25 74.55,48.3 74.55,47.75 74.55,42.75 v74.55,36.6 | v54,59 v52.35,59 | v64.5,55.75 64.25,56 64,56 | 37.75,21.95 v37.7,22 v34.75,24.95 | v35.05,3.05 v34.2,3.05 | 30.3,2.95 v30.3,2 | v44.9,1.9 44.65,1.65
  Bottom 0.813: PL1.G1 94.65,7.76 94.65,5.35 H2.P1 | PL1.G 91.86,64.46 95,67.81 H3.P1 | H4.P1 6.75,68.25 J8.1 | 8.25,10.25 8.25,8.25 H1.P1 5.5,4.5 J11.1 | v74.55,27.9 74.55,28.95 v76.55,30.95 | 75.5,49.25 v77.25,49.25 | 44.65,1.65 36.45,1.65 v35.05,3.05 | v34.2,3.05 30.4,3.05 30.3,2.95
  Bottom 1.016: v4.25,50.99 v10.49,50.99 v10.5,51 | v11.75,43 v23,43
  other vias: 74.6,15.9 72.85,21.5
  pour Bottom (isolate 0.254, rank 2): 0.5,74.5 0.5,0.5 99.5,0.5 99.5,74.5
  pour Top: 49.75,56.75 49.75,59.25 50,59.5 53.75,59.5 54.25,59 54.25,58.65 53.1,57.5 53.1,56.85 52.75,56.5 50,56.5
  pour Top: 58,59.5 56,59.5 55.5,59 55.5,53.7 56.25,52.95 56.25,52 55,50.75 55,50.5 58,50.5 58.5,51 58.5,59
GPIB_ATN  (via drill 0.38)
  Top 0.127: 80.65,27.15 78.3,27.15 U3.9 | U6.2 84.77,68.37 83.65,67.25 83.65,55.8 86.3,53.15 93.1,53.15 94.95,51.3 94.95,31.75 92.05,28.85 88.4,28.85 87.33,27.79 PL1.11
  Top 0.152: 80.65,27.15 v81,27.5
  Bottom 0.152: PL1.11 81.28,27.79 v81,27.5
GPIB_D1  (via drill 0.35)
  Top 0.127: U2.23 65.14,67.27 66.4,66 76.55,66 81.55,61 81.55,52.67 v83.15,51.08 | 81.36,39.05 84,41.7 84,43.55 84.45,44 86.05,44
  Top 0.152: PL1.1 87.8,47.72 87.8,44.7 87.1,44 86.05,44 | U4.2 81.36,39.05
  Bottom 0.127: v83.15,51.08 83.15,50.55 84.33,49.37 PL1.1
GPIB_D2  (via drill 0.35)
  Top 0.127: U2.24 63.87,67.89 66.05,65.7 76.4,65.7 81.15,60.95 81.15,51.85 v82.4,50.6 | PL1.2 84.97,47.22 84,46.25 84,44.5 83.5,44 83.5,42 81.75,40.25 78.85,40.25
  Top 0.152: 78.85,40.25 U4.3
  Bottom 0.127: v82.4,50.6 82.4,49.05 84.23,47.22 PL1.2
GPIB_D3  (via drill 0.38)
  Top 0.127: U2.1 64,62.14 64,60.9 64.95,59.95 77.2,59.95 79.55,57.6 79.55,54 75.4,49.85 75.4,43.1 77,41.5 78.68,41.5 U4.4 82.4,41.6 83.15,42.35 83.15,45.1 v83.35,45.3
  Bottom 0.152: PL1.3 83.59,45.06 v83.35,45.3
GPIB_D4  (via drill 0.38)
  Top 0.127: U2.2 65.14,61.27 66.15,60.25 77.4,60.25 79.9,57.75 79.9,53.83 75.8,49.73 75.8,43.35 76.3,42.85 78.76,42.85 U4.5 | v82.5,42.95 78.86,42.95 78.81,42.89
  Top 0.152: 78.81,42.89 U4.5
  Bottom 0.152: PL1.4 85.89,42.9 85.84,42.95 v82.5,42.95
GPIB_D5  (via drill 0.38)
  Top 0.127: U2.11 76.75,62.09 76.75,61.4 80.25,57.9 80.25,53.65 76.2,49.6 76.2,44.55 76.61,44.13 U4.6 82.03,44.13 82.75,44.85 82.75,45.65 v83.33,46.22
  Bottom 0.152: v83.33,46.22 87.17,46.22 87.75,46.8 87.75,48 89.05,49.3 90.39,49.3 PL1.13
GPIB_D6  (via drill 0.38)
  Top 0.127: U2.12 77.83,60.81 80.6,58.05 80.6,53.5 76.55,49.45 76.55,45.88 77,45.43 78.75,45.43 U4.7 78.88,45.3 v82.05,45.3
  Bottom 0.152: v82.05,45.3 82.45,45.3 83.75,44 87.5,44 88,44.5 88,45.75 89.47,47.22 PL1.14
GPIB_D7  (via drill 0.35)
  Top 0.127: U2.13 77.83,65.72 82.45,61.1 82.45,55.05 85.65,51.85 92.4,51.85 93.35,50.9 93.35,45.21 v93.2,45.06
  Top 0.152: U4.8 80.42,46.67 84.5,50.75 91.5,50.75 92.1,50.15 92.1,45.85 91.31,45.06 PL1.15
  Bottom 0.152: v93.2,45.06 PL1.15
GPIB_D8
  Top 0.127: U2.14 76.56,66.48 82,61.05 82,53.2 83.95,51.25 83.95,51.2 83.95,50.97 80.98,47.99
  Top 0.152: 80.98,47.99 78.83,47.99 U4.9 | 83.95,51.2 91.7,51.2 92.6,50.3 92.6,44.1 91.4,42.9 PL1.16
GPIB_DAV
  Top 0.127: 80.45,24.65 78.29,24.65 U3.7
  Top 0.152: 80.45,24.65 82.25,26.45 82.25,36.75 84.05,38.55 86.11,38.55 PL1.6
GPIB_EOI
  Top 0.127: 80.66,25.91 U3.8 | 85.5,40.74 85.51,40.75 87.25,40.75 88.35,39.65 91.6,39.65 93.85,41.9 93.85,51.05 92.65,52.25 85.9,52.25 82.87,55.28 82.87,61.18 79.34,64.71 79.34,65.55 82.87,69.08 U6.1
  Top 0.152: 80.66,25.91 81.75,27 81.75,37.5 84.99,40.74 85.5,40.74 PL1.5
GPIB_IFC  (via drill 0.35)
  Top 0.127: 80.35,20.85 78.3,20.85 U3.4 | U2.3 66.41,64.36 67,64.95 73.95,64.95 v74.4,64.5 | PL1.9 86.94,32.1 88.25,33.41 88.25,36.9 88.85,37.5 91.75,37.5 94.4,40.15 94.4,51.15 92.85,52.7 86.15,52.7 83.25,55.6 83.25,61.4 79.95,64.7 v79.95,65.05
  Top 0.152: PL1.9 84.35,32.1 83.8,31.55 83.8,24.3 80.35,20.85
  Bottom 0.127: v79.95,65.05 74.95,65.05 v74.4,64.5
GPIB_NDAC
  Top 0.127: 80.1,22.1 U3.5
  Top 0.152: PL1.8 84,34.25 83.25,33.5 83.25,25.25 80.1,22.1
GPIB_NRFD
  Top 0.127: 80.36,23.36 U3.6
  Top 0.152: PL1.7 83.42,36.42 82.75,35.75 82.75,25.75 80.36,23.36
GPIB_REN
  Top 0.127: 76,23.25 76,20.4 76.84,19.55 U3.3
  Top 0.152: 76,23.25 76,32 77.75,33.75 80.25,33.75 81,34.5 81,38 84.8,41.8 89.4,41.8 PL1.17
GPIB_SRQ  (via drill 0.38)
  Top 0.127: 80.5,28.5 78.33,28.5 U3.10
  Top 0.152: 80.5,28.5 80.69,28.7 80.75,28.75 v81,29
  Bottom 0.152: PL1.10 81.94,29.94 v81,29
HC595_RCLK
  Top 0.127: 65.8,63.8 64.86,64.75 52.65,64.75 51.77,63.87 51.77,60.86 U1.42 51.67,61.98 49.5,64.15 R36.2
  Top 0.15: 65.8,63.8 65.8,61.15 66.36,60.59 73.09,60.59 74.25,61.75 74.03,61.98 U2.9
I2C_VDDIO  (via drill 0.35)  (5 unrouted)
  Top 0.127: R31.2 31.1,20.9
  Top 0.305: J10.2 69.5,9.5 69,10 R14.1 67.9,12.5 R15.1 | Q1.5 65,18.2 Q1.2
  Top 0.406: 31.1,20.9 31.9,20.9 | R15.1 67.25,13.45 67.1,13.45 65.6,14.95 | 65.6,14.95 64.95,15.6 | C18.1 65.6,14.95
  Top 0.508: 65,15.65 65,18.2
  Top 0.813: 64.95,15.6 65,15.65 | v54.2,17.4 54.25,17.4 54.45,17.6 61.79,17.6 63.75,15.65 65.05,15.65 67.25,13.45 | 31.9,20.9 35.5,17.3 44.5,17.3 v44.55,17.25
  Bottom 0.813: v44.55,17.25 44.8,17.4 v54.2,17.4 | 44.85,17.2 43.65,17.2 | 55.05,17.4 53.85,17.4
  other vias: 55.05,17.45 43.65,17.25
MISO  (via drill 0.35, 0.38)
  Top 0.127: 40.79,70.04 J2.1 41.75,71.1 42.8,70.05 44.55,70.05 v45,70.5 | U1.2 48.18,58.25 47,58.25 45,60.25 45,62.9 v45.05,62.95 45.05,68.7 v45,68.75 | v42.27,62.85 42.38,62.75 42.38,61.62 40.75,60 36.75,60 33.77,57.02 R55.2
  Bottom 0.127: v45.05,62.95 44.95,62.85 v42.27,62.85 | v45,68.75 v45,70.5
MISO_5V
  Top 0.127: U8.3 33.96,31.4 32.65,32.71 32.65,51.77 33.77,52.89 R55.1
MOSI  (via drill 0.38)
  Top 0.127: R57.2 31.45,56.75 35.7,61 v38,61 38,63.65 | U1.1 47.02,58.96 45.88,60.1 45.88,60.72 v45.8,60.8 | 42.1,69.7 38.25,65.85 J2.4 | 63.55,72.9 66.1,72.9 66.41,72.59 U2.22
  Top 0.15: 63.55,72.9 63.25,72.6 63.25,69 62.25,68 57,68 55.3,69.7 42.1,69.7
  Top 0.178: J2.4 38.25,63.9 38,63.65
  Bottom 0.127: v45.8,60.8 45.6,61 v38,61
MOSI_5V0  (via drill 0.35)
  Top 0.127: R57.1 31.45,52.68 31.85,52.28 31.85,31.15 v32.69,30.31 v32.69,30.3 | U12.9 43.55,23.2 42.3,24.45 42.3,25.4 40.65,27.05 37.45,27.05 v33.4,31.1
  Bottom 0.127: v32.69,30.3 33.35,30.96 33.35,31.1 v33.4,31.1
N$1
  Top 0.406: R1.2 R49.1 20.22,39 18.25,39 17.25,40 U9.1
N$2  (via drill 0.35)
  Top 0.127: U1.25 59.93,52.5 60.75,52.5 61.1,52.15 61.1,51.65 61.45,51.3 61.45,48.3 v61.5,48.25 | v61.7,41.4 61.7,35.85 66.4,31.15 66.4,28.35 66.42,28.33 v66.42,28.3 | v65.65,22.5 65.65,20.9 67.25,19.3 67.25,16.45 68.05,15.65 69.45,15.65 74.8,10.3 75.8,10.3 R2.1
  Bottom 0.127: v61.5,48.25 61.5,41.9 61.7,41.7 v61.7,41.4 | v66.42,28.3 66.42,24.12 65.65,23.35 v65.65,22.5
N$5
  Top 0.127: R52.2 28.5,8.46 28.5,4.52 28.25,4.27
  Top 0.178: R52.2 27.15,9.3 | 28.25,4.27 LED6.A
N$6  (via drill 0.35)
  Top 0.127: v67.65,64.29 67.67,64.27 U2.4 | v67.75,66.55 67.9,66.4 72.55,66.4 75.95,69.8 75.95,72.55 76.15,72.75 78.7,72.75 80.25,71.2 82.35,71.2 82.7,70.85 84.89,70.85 U6.4
  Bottom 0.127: v67.65,64.29 67.7,64.34 67.7,66.5 v67.75,66.55
N$7
  Top 0.254: R23.1 8.87,42.48 LED3.A
N$8
  Top 0.152: U11.3 25.25,69.98 25.25,71 24.75,71.5 22.22,71.5 S1.4 S1.3
N$9
  Top 0.178: R6.2 23.47,5.64 LED5.A
N$10  (via drill 0.35)
  Top 0.127: 76.5,12.35 76.56,12.35 76.6,12.35 85.75,21.5 91.25,21.5 95.5,25.75 95.5,61.45 88.25,68.7 88.25,71.75 85.75,74.25 59,74.25 55.25,70.5 v46,70.5 | U1.44 49.33,61.5 46.25,61.5 45.75,62 45.75,68.5 v46,68.75
  Top 0.15: 76.56,12.35 R53.1
  Bottom 0.127: v46,68.75 v46,70.5 45.95,70.55
N$11
  Top 0.127: 28.77,10.8 R17.1 29,11.03 29,2.25 30.75,0.5 31.75,0.5 32.28,1.03 J3.8
N$12
  Top 0.152: U11.2 27.7,70.4 R7.2 29.6,70.5 31.5,70.5 R3.1
N$13
  Top 0.127: J3.1 40.51,2.4 41.65,2.4 45.95,6.7 45.95,20.95 48.55,23.55 R16.1
N$16
  Top 0.254: U5.1 60.66,29.64 Y1.X2
N$17
  Top 0.406: U5.3 58.12,23.46 48.4,13.75 BT1.VCC@1
N$18
  Top 0.254: U5.2 59.38,27.32 Y1.X1
N$19
  Top 0.254: R24.1 7.31,34.13 LED4.A
N$21
  Top 0.15: R2.2 77.57,7.17 77.35,6.95 76.27,6.95 LED1.A
N$22
  Top 0.15: R53.2 79.35,11.26 79.35,7.01 LED2.A
NRESET  (via drill 0.38)
  Top 0.127: v44,70.76 44,71.5 42.25,73.25 37,73.25 35.71,71.96 J2.5 | v44,68.75 44,59.6 47.05,56.55 U1.4
  Top 0.152: R7.1 30.4,73 33.5,73 35.4,71.1 J2.5
  Bottom 0.127: v44,70.76 v44,68.75
PA0
  Top 0.127: U1.37 55.67,62.17 57,63.5 60.85,63.5 64.75,59.6 76.95,59.6 78.5,58.05 R8.2
PA0_D1
  Top 0.127: U4.19 71.11,39.05 73.9,41.85 73.9,49.35 78.5,53.95 R8.1
PA1
  Top 0.127: U1.36 56.5,60.79 56.5,62.25 57.25,63 61,63 64.7,59.3 75.3,59.3 76.6,58 R9.2
PA1_D2
  Top 0.127: U4.18 68.8,40.25 71.65,40.25 73.55,42.15 73.55,50.95 R9.1
PA2
  Top 0.127: U1.35 57.27,61.98 57.25,62 57.75,62.5 61.15,62.5 64.65,59 73.2,59 R10.2
PA2_D3
  Top 0.127: U4.17 72.44,41.59 73.25,42.4 73.25,51.2 74.8,52.75 R10.1
PA3
  Top 0.127: U1.34 58.07,61.82 58.25,62 61.25,62 64.55,58.7 70.3,58.7 R11.2
PA3_D4
  Top 0.127: U4.16 71.72,42.87 72.5,43.65 72.5,50.95 73,51.45 R11.1
PA4
  Top 0.127: U1.33 63.59,58.96 64.65,57.9 R13.2
PA4_D5
  Top 0.127: R13.1 70.15,57.9 72.08,55.98 72.08,44.77 71.44,44.13 U4.15
PA5
  Top 0.127: R25.2 65.35,56.4 63.59,58.16 U1.32
PA5_D6
  Top 0.127: R25.1 70.8,56.4 71.75,55.45 71.75,45.85 71.31,45.41 U4.14
PA6
  Top 0.127: R26.2 70.15,55.5 67.5,55.5 66.9,56.1 65.3,56.1 64.03,57.37 U1.31
PA6_D7
  Top 0.127: R26.1 70.9,47.15 70.5,46.75 68.8,46.75 U4.13
PA7
  Top 0.127: U1.30 64.39,56.56 65.2,55.75 66.75,55.75 67.33,55.17 68.68,55.17 69.3,54.55 R27.2
PA7_D8
  Top 0.127: U4.12 69.93,47.95 70.25,48.26 70.25,50.75 69.3,51.7 R27.1
PB0_EOI  (via drill 0.38)
  Top 0.127: v53.59,62.26 53.27,61.94 U1.40 | v65.9,54 65.8,54 65.8,51.35 65.53,51.08 65.53,44.23 65.45,44.15 65.45,34.25 68.1,31.6 70.55,31.6 71.15,31 71.15,26.65 70.41,25.91 U3.17
  Bottom 0.127: v65.9,54 66.2,54.3 66.2,55.5 61.82,59.88 55.35,59.88 53.59,61.64 v53.59,62.26
PB1_DAV  (via drill 0.38)
  Top 0.127: v52.5,62.25 52.5,60.79 U1.41 | v65.1,54.2 65.41,54.5 66.15,54.5 66.5,54.15 66.5,53.65 66.15,53.3 66.15,50.9 65.8,50.55 65.8,34.45 68.25,32 70.65,32 71.5,31.15 71.5,25.4 70.7,24.6 69.26,24.6 U3.18
  Bottom 0.127: v52.5,62.25 55.2,59.55 61.75,59.55 65.9,55.4 65.9,54.85 65.25,54.2 v65.1,54.2
PB3_CS  (via drill 0.38)
  Top 0.127: R58.2 27.54,55.96 28.55,54.95 32.35,54.95 32.55,54.75 | U1.43 50.75,60.88 50.75,61.6 50.11,62.24 v46.64,62.24 | v41.65,62.21 41.65,61.51 40.52,60.38 36.08,60.38 32.55,56.85 32.55,54.75 | U12.2 38,25.8 32.25,31.55 32.25,52.2 32.55,52.5 32.55,54.75
  Bottom 0.127: v41.65,62.21 41.62,62.24 v46.64,62.24
PC7_CD  (via drill 0.35)  (1 unrouted)
  Top 0.127: v66.25,23.1 66.3,23.05 66.3,23 65.78,23.52 59.48,23.52 58.75,24.25 58.75,26.2 57.7,27.25 56.45,27.25 55.7,26.5 55.7,23.55 R54.2 | v67,27.75 66.9,27.85 66.9,31.25 62.18,35.97 62.18,42.13 v62.07,42.25 | v62.07,47.78 62.07,51.13 61.38,51.82 61.38,53.02 61.05,53.35 U1.26
  Bottom 0.127: v66.25,23.1 66.25,23.4 66.85,24 66.85,27.7 66.9,27.75 v67,27.75 | v62.07,42.25 61.9,42.42 61.9,47.7 61.98,47.78 v62.07,47.78
PD2_NRFD
  Top 0.127: U1.11 49.45,49.78 49.45,43.95 63.25,30.15 63.25,26.85 64.2,25.9 66,25.9 68.65,23.25 69.11,23.25 U3.19
PD3_NDAC  (via drill 0.38)
  Top 0.127: U1.12 50.07,43.78 54.75,39.1 63.75,30.1 63.75,27.15 v64.05,26.85 | v64.05,25.4 66,25.4 67.75,23.65 67.75,22.25 67.9,22.1 U3.20
  Bottom 0.127: v64.05,26.85 v64.05,25.4
PD4_IFC  (via drill 0.38)
  Top 0.127: U1.13 50.82,49.11 50.82,43.48 64.25,30.05 64.25,27.45 64.9,26.8 v64.9,26.55 | v64.7,24.8 66.05,24.8 67.38,23.48 67.38,21.62 68.15,20.85 69.2,20.85 U3.21
  Bottom 0.127: v64.9,26.55 64.9,26.1 64.7,25.9 v64.7,24.8
PD5_SRQ
  Top 0.127: U1.14 51.67,45.42 51.39,45.15 51.39,45.14 51.25,45 51.25,43.5 64.6,30.15 64.6,27.7 65.8,26.5 70.45,26.5 70.8,26.85 70.8,27.6 69.95,28.45 U3.15
PD6_ATN
  Top 0.127: 52.5,49.19 U1.15 52.47,45.72 51.75,45 51.75,43.45 65,30.2 65,27.85 65.67,27.18 U3.16
PD7_REN  (via drill 0.38)
  Top 0.127: v52.45,44.6 52.5,44.6 53.22,45.32 53.22,49.11 U1.16 | v48.9,44.59 48.9,44.09 62.85,30.14 62.85,25.75 64.35,24.25 66.05,24.25 66.95,23.35 66.95,20.61 68,19.55 U3.22
  Bottom 0.127: v52.45,44.6 48.91,44.6 v48.9,44.59
PE  (via drill 0.38)
  Top 0.127: v67,44.55 67,48.75 67.47,49.22 U4.11 | U1.22 58.09,49.14 58.15,49.08 | 58.15,49.08 62.97,44.26 J9.3 | R33.2 58.95,47.15 58.15,47.95 58.15,49.08
  Bottom 0.127: v67,44.55 66.71,44.26 J9.3
PWRIN1
  Top 1.27: J1.VIN0 6.74,61.65 16.12,61.65 D2.A
RXD
  Top 0.127: U1.9 47.06,52.56 46.25,51.75 46.25,50.5 44.74,48.99 R19.1
RXLED
  Top 0.178: LED5.C 22.1,10.3 21.32,11.07 U7.22
SC  (via drill 0.35)
  Top 0.127: U1.24 59.93,51.7 60.5,51.7 60.9,51.3 60.9,48.1 62.2,46.8 J9.1 | U3.1 78.26,17 76.85,17 75.3,18.55 75.3,28 70.95,32.35 68.4,32.35 66.85,33.9 R35.2 66.25,36.05 66.25,46.75 v66.5,47
  Bottom 0.127: v66.5,47 66.3,46.8 J9.1
SCK  (via drill 0.38)
  Top 0.127: J2.3 38.2,71.05 | 38.2,71.05 37.75,70.6 37.75,69.75 36.5,68.5 33.5,68.5 29.63,64.63 R56.2 | U1.3 47.14,57.36 44.45,60.05 44.45,67.75 44.5,67.81 44.5,69.3 | v43.1,69.04 43.36,69.3 44.5,69.3 | 38.2,71.05 38.2,72.2 38.75,72.75 42,72.75 43.15,71.6 v43.15,70.8 | 75.3,64.81 74.74,65.36 65.85,65.36 63.71,67.5 56.95,67.5 55.15,69.3 44.5,69.3
  Top 0.15: 75.3,64.81 U2.10
  Bottom 0.127: v43.15,70.8 43.15,69.09 v43.1,69.04
SCL  (via drill 0.35)
  Top 0.127: J10.4 71.5,10.6 R14.2 70.9,11.6 70.9,13.8 69.45,15.25 67.95,15.25 66.9,16.3 66.9,18.77 v66.02,19.65 | v64.8,19.65 64.6,19.65 64.05,19.1 Q1.1
  Bottom 0.127: v66.02,19.65 v64.8,19.65
SD_CD  (via drill 0.35)
  Top 0.127: R12.1 49.96,21.48 R54.1 49.76,19.51 v46.8,16.55 | J3.10 39.34,16.25 v44.8,16.25 44.85,16.25
  Bottom 0.127: v44.8,16.25 45.6,16.25 45.9,16.55 v46.8,16.55
SD_CLK  (via drill 0.35)
  Top 0.127: U12.6 38.98,23.25 41.3,23.25 42.8,21.75 44,21.75 v44.1,21.85 | J3.5 35.58,1.67 36.25,1 40.7,1 46.2,6.5 46.2,20.35 v46.5,20.65
  Bottom 0.127: v46.5,20.65 46.5,20.6 45.35,20.6 v44.1,21.85
SD_CS  (via drill 0.35)
  Top 0.127: U12.3 39.9,25.15 42.83,22.22 v43.2,22.22 | J3.2 38.88,2.16 39.43,2.71 41.46,2.71 45.65,6.9 45.65,19.55 v45.15,20.05
  Bottom 0.127: v45.15,20.05 43.25,21.95 43.25,22.22 v43.2,22.22
SD_MISO
  Top 0.127: U8.2 40.15,32.05 41.7,33.6 48.95,33.6 50.5,32.05 50.5,26.7 49.94,26.14 R18.1 49.94,25.56 50.8,24.7 50.8,18.55 46.45,14.2 46.45,6.3 40.85,0.7 34,0.7 33.45,1.25 33.45,1.8 J3.7
SD_MOSI  (via drill 0.35)
  Top 0.127: J3.3 37.78,2.21 38.58,3.01 41.26,3.01 45.37,7.12 45.37,18.9 45.08,19.19 v45.08,19.3 | U12.8 44.62,22.5 44.62,21.57 44.27,21.22 43.13,21.22 v43.08,21.27 43.1,21.3
  Bottom 0.127: v43.08,21.27 45.08,19.27 v45.08,19.3
SDA
  Top 0.127: J10.3 70.5,9.5 69.85,10.15 69.85,13.2 R15.2 69.26,13.45 65.95,16.76 Q1.4
TE  (via drill 0.38)
  Top 0.127: U4.1 78.78,35.53 76,32.75 68.55,32.75 67.65,33.65 67.65,36.3 66.9,37.05 66.9,42.9 v67.05,43.05 | J9.4 62.96,42.99 62.05,43.9 R5.2 58.95,44.5 58.05,45.4 58.05,46.95 57.27,47.73 U1.21
  Top 0.15: 75.65,32.75 75.65,19.45 76.85,18.25 78.24,18.25 U3.2 | 76,32.75 75.55,32.75
  Top 0.152: 75.55,32.75 75.65,32.75
  Bottom 0.127: v67.05,43.05 63.56,43.05 J9.4
  pour Top: 76,32.75 75.75,32.5 75.5,32.5 75.25,32.75
TXD
  Top 0.127: U1.10 47.26,51.76 46.86,51.36 46.86,50.36 45.96,49.46 45.96,47.71 45.21,46.96 R20.1
TXLED
  Top 0.178: LED6.C 25.1,7.9 21.98,11.03 U7.23
USBVCC
  Top 0.305: C16.1 20.02,10.09 20.02,12 U7.20
  Top 0.406: C17.+ 15.25,22.29 15.25,18 20.02,13.22 20.02,12
  Top 0.813: F2.2 14.81,23.4 C17.+
VIN
  Top 0.813: J5.1 18.83,51.5
  Top 1.016: 12.75,40.75 12.75,40.08 U9.3
  Top 1.27: D2.C 18.83,51.5 18.83,49.08 17.95,48.2 C14.+ 17.95,45.95 12.75,40.75
VUSB1
  Top 0.61: J4.VBUS 8.05,18.35 9.05,19.35 9.85,19.35 10.75,20.25 10.73,20.27 C11.1 12.95,22.06 F2.1
XT1
  Top 0.254: U1.8 46.76,53.36 46.3,52.9 43.15,52.9 42.13,51.88 Y2.3 C4.2
XT2
  Top 0.254: U1.7 44.72,54.16 Y2.1 44.13,54.75 42.87,54.75 41.82,55.8 C3.2

## Text on the board
tPlace: 1 | GND | ISP | VIN | SC | DC | PE | HP85Disk | TE | 5V0 | Mike Gore | Jay Hamlin | Board rev 03b | 3V3 | uSD | 03/15/2020 | RX | TX | CR1225 | QUIIC
Measures: Units in inches
214bmp: D:/SmartProjects/Snc/a4_bn_logo2.bmp